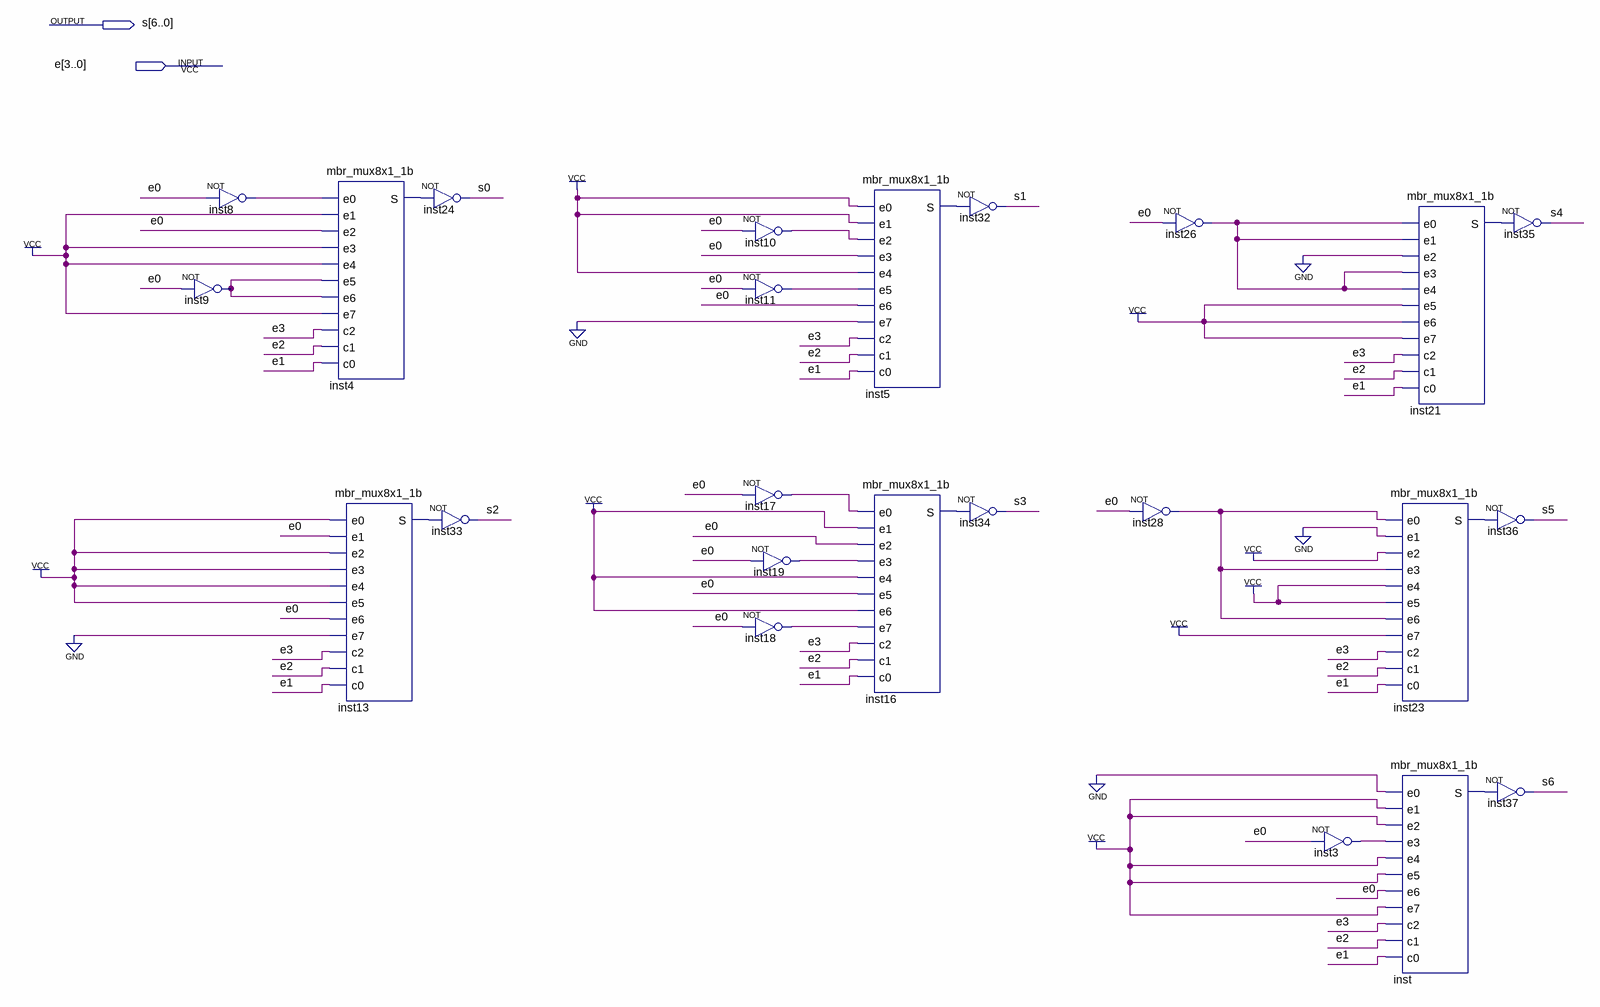
[diagram p0: schematic sheet]
// Quartus schematic mbr_disp_7_seg.bdf as structural Verilog: 24 symbols, 2 pins
module mbr_disp_7_seg (
  input  [3:0] e,
  output [6:0] s
);

  wire inst3_out, inst4_s, inst5_s, inst8_out, inst9_out, inst10_out, inst11_out, inst13_s, inst16_s,
       inst17_out, inst18_out, inst19_out, inst21_s, inst23_s, inst26_out, inst28_out, inst_s;

  not inst9 (inst9_out, e[0]);
  not inst8 (inst8_out, e[0]);
  mbr_mux8x1_1b inst4 (
    .e0(inst8_out), .e1(1'b1), .e2(e[0]), .e3(1'b1), .e4(1'b1), .e5(inst9_out), .e6(inst9_out), .e7(1'b1),
    .c2(e[3]), .c1(e[2]), .c0(e[1]), .S(inst4_s));
  mbr_mux8x1_1b inst13 (
    .e0(1'b1), .e1(e[0]), .e2(1'b1), .e3(1'b1), .e4(1'b1), .e5(1'b1), .e6(e[0]), .e7(1'b0), .c2(e[3]),
    .c1(e[2]), .c0(e[1]), .S(inst13_s));
  not inst24 (s[0], inst4_s);
  not inst33 (s[2], inst13_s);
  not inst10 (inst10_out, e[0]);
  not inst11 (inst11_out, e[0]);
  not inst17 (inst17_out, e[0]);
  not inst19 (inst19_out, e[0]);
  not inst18 (inst18_out, e[0]);
  mbr_mux8x1_1b inst5 (
    .e0(1'b1), .e1(1'b1), .e2(inst10_out), .e3(e[0]), .e4(1'b1), .e5(inst11_out), .e6(e[0]), .e7(1'b0),
    .c2(e[3]), .c1(e[2]), .c0(e[1]), .S(inst5_s));
  mbr_mux8x1_1b inst16 (
    .e0(inst17_out), .e1(1'b1), .e2(e[0]), .e3(inst19_out), .e4(1'b1), .e5(e[0]), .e6(1'b1), .e7(inst18_out),
    .c2(e[3]), .c1(e[2]), .c0(e[1]), .S(inst16_s));
  not inst32 (s[1], inst5_s);
  not inst34 (s[3], inst16_s);
  not inst26 (inst26_out, e[0]);
  not inst28 (inst28_out, e[0]);
  not inst3 (inst3_out, e[0]);
  mbr_mux8x1_1b inst21 (
    .e0(inst26_out), .e1(inst26_out), .e2(1'b0), .e3(inst26_out), .e4(inst26_out), .e5(1'b1), .e6(1'b1),
    .e7(1'b1), .c2(e[3]), .c1(e[2]), .c0(e[1]), .S(inst21_s));
  mbr_mux8x1_1b inst23 (
    .e0(inst28_out), .e1(1'b0), .e2(1'b1), .e3(inst28_out), .e4(1'b1), .e5(1'b1), .e6(inst28_out), .e7(1'b1),
    .c2(e[3]), .c1(e[2]), .c0(e[1]), .S(inst23_s));
  mbr_mux8x1_1b inst (
    .e0(1'b0), .e1(1'b1), .e2(1'b1), .e3(inst3_out), .e4(1'b1), .e5(1'b1), .e6(e[0]), .e7(1'b1), .c2(e[3]),
    .c1(e[2]), .c0(e[1]), .S(inst_s));
  not inst35 (s[4], inst21_s);
  not inst36 (s[5], inst23_s);
  not inst37 (s[6], inst_s);
endmodule
